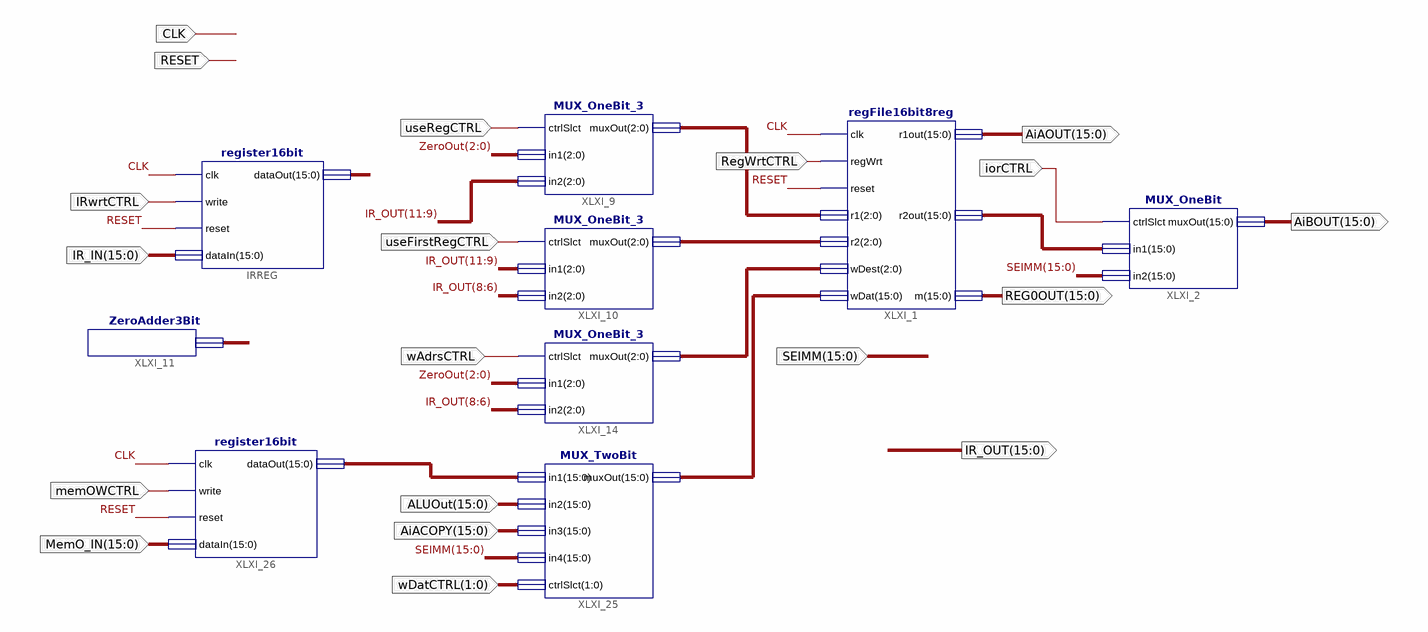
[diagram p0: schematic sheet 1]
// Xilinx ISE schematic RegFileALU_Schematic.sch (spartan3e) as structural Verilog: 9 symbols, 19 ports
module RegFileALU_Schematic (
  input  [15:0] ALUOut,
  input  [15:0] AiACOPY,
  input  [1:0] wDatCTRL,
  input  wAdrsCTRL,
  input  useFirstRegCTRL,
  input  useRegCTRL,
  input  CLK,
  input  RESET,
  input  IRwrtCTRL,
  input  memOWCTRL,
  input  RegWrtCTRL,
  input  [15:0] SEIMM,
  input  iorCTRL,
  input  [15:0] IR_IN,
  input  [15:0] MemO_IN,
  output [15:0] IR_OUT,
  output [15:0] REG0OUT,
  output [15:0] AiAOUT,
  output [15:0] AiBOUT
);

  wire [2:0] XLXN_27, XLXN_28, XLXN_29, ZeroOut;
  wire [15:0] XLXN_1, XLXN_30, XLXN_31;

  register16bit IRREG (.clk(CLK), .write(IRwrtCTRL), .reset(RESET), .dataIn(IR_IN), .dataOut(IR_OUT));
  regFile16bit8reg XLXI_1 (
    .clk(CLK), .regWrt(RegWrtCTRL), .reset(RESET), .r1(XLXN_27), .r2(XLXN_28), .wDest(XLXN_29),
    .wDat(XLXN_30), .r1out(AiAOUT), .r2out(XLXN_1), .m(REG0OUT));
  MUX_OneBit XLXI_2 (.ctrlSlct(iorCTRL), .in1(XLXN_1), .in2(SEIMM), .muxOut(AiBOUT));
  MUX_OneBit_3 XLXI_9 (.ctrlSlct(useRegCTRL), .in1(ZeroOut), .in2(IR_OUT[11:9]), .muxOut(XLXN_27));
  ZeroAdder3Bit XLXI_11 (.constantZero(ZeroOut));
  MUX_OneBit_3 XLXI_14 (.ctrlSlct(wAdrsCTRL), .in1(ZeroOut), .in2(IR_OUT[8:6]), .muxOut(XLXN_29));
  MUX_OneBit_3 XLXI_10 (.ctrlSlct(useFirstRegCTRL), .in1(IR_OUT[11:9]), .in2(IR_OUT[8:6]), .muxOut(XLXN_28));
  MUX_TwoBit XLXI_25 (.in1(XLXN_31), .in2(ALUOut), .in3(AiACOPY), .in4(SEIMM), .ctrlSlct(wDatCTRL), .muxOut(XLXN_30));
  register16bit XLXI_26 (.clk(CLK), .write(memOWCTRL), .reset(RESET), .dataIn(MemO_IN), .dataOut(XLXN_31));
endmodule
